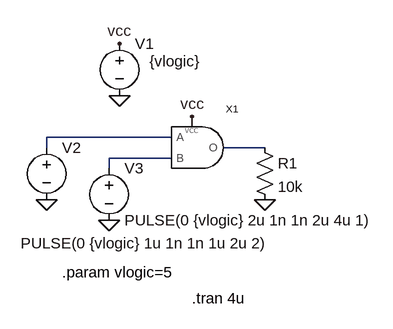
[diagram p0: schematic test_oddities.asc]
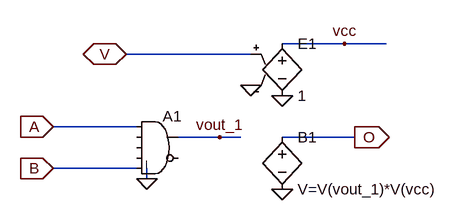
[diagram p1: sub-circuit logic_and.asc]
test_oddities.asc, the LTspice schematic file:
Version 4.1
SHEET 1 880 680
WIRE 176 128 -16 128
WIRE -16 144 -16 128
WIRE 320 144 256 144
WIRE 176 160 80 160
WIRE 80 176 80 160
FLAG 96 64 0
FLAG 208 96 vcc
FLAG 96 -16 vcc
FLAG 320 224 0
FLAG -16 224 0
FLAG 80 256 0
SYMBOL LTSpice\ Library\ with\ \ spaces\\logic_and 176 112 R0
SYMATTR InstName X1
SYMBOL voltage 96 -32 R0
WINDOW 3 46 43 Left 2
SYMATTR InstName V1
SYMATTR Value {vlogic}
SYMBOL res 304 128 R0
SYMATTR InstName R1
SYMATTR Value 10k
SYMBOL voltage -16 128 R0
WINDOW 3 -40 163 Left 2
WINDOW 123 0 0 Left 0
WINDOW 39 0 0 Left 0
SYMATTR InstName V2
SYMATTR Value PULSE(0 {vlogic} 1u 1n 1n 1u 2u 2)
SYMBOL voltage 80 160 R0
WINDOW 123 0 0 Left 0
WINDOW 39 0 0 Left 0
SYMATTR InstName V3
SYMATTR Value PULSE(0 {vlogic} 2u 1n 1n 2u 4u 1)
TEXT 208 376 Left 2 !.tran 4u
TEXT 8 336 Left 2 !.param vlogic=5

logic_and.asc, the sub-circuit schematic file:
Version 4.1
SHEET 1 880 680
WIRE 368 32 272 32
WIRE 432 32 368 32
WIRE 224 48 32 48
WIRE 48 160 -80 160
WIRE 176 176 112 176
WIRE 208 176 176 176
WIRE 384 176 272 176
WIRE 48 224 -80 224
WIRE 64 240 64 224
FLAG -80 160 A
IOPIN -80 160 In
FLAG -80 224 B
IOPIN -80 224 In
FLAG 384 176 O
IOPIN 384 176 Out
FLAG 32 48 V
IOPIN 32 48 BiDir
FLAG 272 256 0
FLAG 176 176 vout_1
FLAG 224 96 0
FLAG 272 112 0
FLAG 64 240 0
FLAG 368 32 vcc
SYMBOL Digital\\and 80 128 R0
SYMATTR InstName A1
SYMBOL bv 272 160 R0
SYMATTR InstName B1
SYMATTR Value V=V(vout_1)*V(vcc)
SYMBOL e 272 16 R0
SYMATTR InstName E1
SYMATTR Value 1

The netlist it stands for:
* test_oddities.asc
X§X1 N001 N003 vcc N002 logic_and
V1 vcc 0 {vlogic}
R1 N002 0 10k
V2 N001 0 PULSE(0 {vlogic} 1u 1n 1n 1u 2u 2)
V3 N003 0 PULSE(0 {vlogic} 2u 1n 1n 2u 4u 1)

* block symbol definitions
.subckt logic_and A B V O
A1 A 0 0 0 B 0 vout_1 0 AND
B1 O 0 V=V(vout_1)*V(vcc)
E1 vcc 0 V 0 1
.ends logic_and

.tran 4u
.param vlogic=5
.backanno
.end